# Altium project ESC.PrjPcb
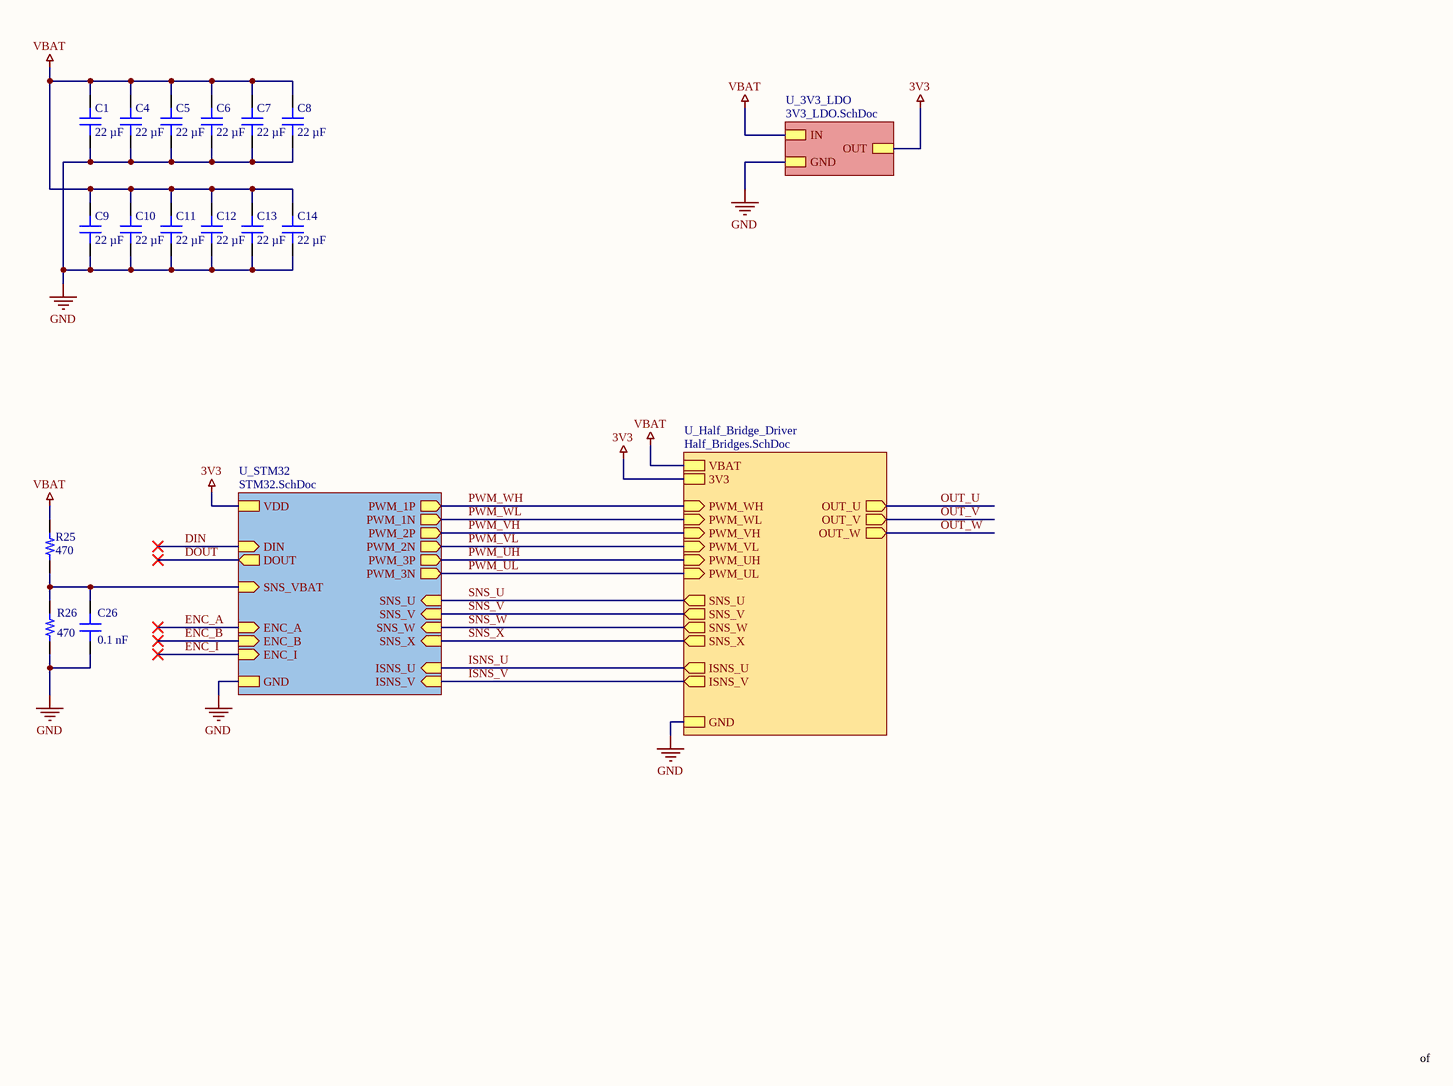
[diagram p0: Top.SchDoc]
DrawnBy: Shivam Sharma; Project: ESC; Revision: 1.0
4 sheets, 65 parts. Net scope: strictly hierarchical (ports join the sheet entries above them; power ports are local).
Board file: ESC.PcbDoc
Sheets:
  Top.SchDoc
    U_STM32 = STM32.SchDoc
    U_Half_Bridge_Driver = Half_Bridges.SchDoc
    U_3V3_LDO = 3V3_LDO.SchDoc

## Sheet Top.SchDoc
size B; SheetNumber: 1; SheetTotal: 4

### Parts
C1  22 µF  [CAP 0805_2012]
C4  22 µF  [CAP 0805_2012]
C5  22 µF  [CAP 0805_2012]
C6  22 µF  [CAP 0805_2012]
C7  22 µF  [CAP 0805_2012]
C8  22 µF  [CAP 0805_2012]
C9  22 µF  [CAP 0805_2012]
C10  22 µF  [CAP 0805_2012]
C11  22 µF  [CAP 0805_2012]
C12  22 µF  [CAP 0805_2012]
C13  22 µF  [CAP 0805_2012]
C14  22 µF  [CAP 0805_2012]
C26  0.1 nF  [CAP 0402_1005]
R25  470  [RES 0402_1005]
R26  470  [RES 0402_1005]

### Sub-sheets
U_3V3_LDO = 3V3_LDO.SchDoc: OUT, IN, GND
U_Half_Bridge_Driver = Half_Bridges.SchDoc: VBAT, GND, PWM_UH (in), PWM_UL (in), PWM_VH (in), PWM_VL (in), PWM_WH (in), PWM_WL (in), SNS_U (out), SNS_V (out), SNS_W (out), SNS_X (out), OUT_U (out), OUT_V (out), OUT_W (out), ISNS_U (out), ISNS_V (out), 3V3
U_STM32 = STM32.SchDoc: VDD, GND, PWM_2N (out), PWM_3N (out), PWM_1N (out), PWM_1P (out), PWM_2P (out), PWM_3P (out), ISNS_V (in), ISNS_U (in), SNS_X (in), SNS_W (in), SNS_V (in), SNS_U (in), ENC_A (in), ENC_B (in), ENC_I (in), DIN (in), DOUT (out), SNS_VBAT (in)

### Nets
3V3: sheet U_STM32/VDD, sheet U_Half_Bridge_Driver/3V3, sheet U_3V3_LDO/OUT
GND: C1.1 C4.1 C5.1 C6.1 C7.1 C8.1 C9.1 C10.1 C11.1 C12.1 C13.1 C14.1 C26.1 R26.1 ; sheet U_STM32/GND, sheet U_Half_Bridge_Driver/GND, sheet U_3V3_LDO/GND
VBAT: C1.2 C4.2 C5.2 C6.2 C7.2 C8.2 C9.2 C10.2 C11.2 C12.2 C13.2 C14.2 R25.2 ; sheet U_Half_Bridge_Driver/VBAT, sheet U_3V3_LDO/IN
ISNS_U: sheet U_STM32/ISNS_U, sheet U_Half_Bridge_Driver/ISNS_U
ISNS_V: sheet U_STM32/ISNS_V, sheet U_Half_Bridge_Driver/ISNS_V
PWM_UH: sheet U_STM32/PWM_3P, sheet U_Half_Bridge_Driver/PWM_UH
PWM_UL: sheet U_STM32/PWM_3N, sheet U_Half_Bridge_Driver/PWM_UL
PWM_VH: sheet U_STM32/PWM_2P, sheet U_Half_Bridge_Driver/PWM_VH
PWM_VL: sheet U_STM32/PWM_2N, sheet U_Half_Bridge_Driver/PWM_VL
PWM_WH: sheet U_STM32/PWM_1P, sheet U_Half_Bridge_Driver/PWM_WH
PWM_WL: sheet U_STM32/PWM_1N, sheet U_Half_Bridge_Driver/PWM_WL
SNS_U: sheet U_STM32/SNS_U, sheet U_Half_Bridge_Driver/SNS_U
SNS_V: sheet U_STM32/SNS_V, sheet U_Half_Bridge_Driver/SNS_V
SNS_VBAT: C26.2 R25.1 R26.2 ; sheet U_STM32/SNS_VBAT
SNS_W: sheet U_STM32/SNS_W, sheet U_Half_Bridge_Driver/SNS_W
SNS_X: sheet U_STM32/SNS_X, sheet U_Half_Bridge_Driver/SNS_X

### Notes on the sheet
- of

### Library data of the parts
C1 C4-C14 = CC0805MKX5R8BB226: CAP CER 22UF 25V X5R 0805; manufacturer: Yageo; Tolerance: ±20%; Part Number: CC0805MKX5R8BB226; Value: 22 µF; Applications: General Purpose; Capacitance: 22 µF; componentlink1description: Datasheet; componentlink1url: https://www.yageo.com/upload/media/product/productsearch/datasheet/mlcc/UPY-GPHC_X5R_4V-to-50V_25.pdf; componentlink2description: DigiKey Link; componentlink2url: https://www.digikey.com/en/products/detail/yageo/CC0805MKX5R8BB226/5195309; Device Package: 0805 (2012 Metric); lastupdated: 8/21/2022 8:03:23 PM; Lifecycle Status: Active; Minimum Order: 1; Mounting Type: Surface Mount, MLCC; Operating Temperature: -55°C ~ 85°C; Package / Case: 0805 (2012 Metric); packaging: TapeAndReel; partid: 39226; Part Status: Active; price: 0.10; series: CC; Size / Dimension: 0.079" L x 0.049" W (2.00mm x 1.25mm); Supplier 1: DigiKey; Supplier Part Number 1: 311-1903-1-ND; Temperature Coefficient: X5R; Thickness (Max): 0.057" (1.45mm); Voltage - Rated: 25V
C26 = C0402C104K4RACAUTO: CAP CER 0.1UF 16V X7R 0402; manufacturer: KEMET; Capacitance: 0.1 µF; Tolerance: ±10%; Part Number: C0402C104K4RACAUTO; Value: 0.1 nF; Applications: Automotive, Bypass, Decoupling; componentlink1description: Datasheet; componentlink1url: https://api.kemet.com/component-edge/download/specsheet/C0402C104K4RACAUTO.pdf; componentlink2description: DigiKey Link; componentlink2url: https://www.digikey.com/en/products/detail/kemet/C0402C104K4RACAUTO/3314827; Device Package: 0402 (1005 Metric); lastupdated: 8/14/2022 9:05:51 PM; Lifecycle Status: Active; Minimum Order: 1; Mounting Type: Surface Mount, MLCC; Operating Temperature: -55°C ~ 125°C; Package / Case: 0402 (1005 Metric); packaging: TapeAndReel; partid: 3024; Part Status: Active; price: 0.01; Ratings: AEC-Q200; series: SMD Auto X7R; Size / Dimension: 0.039" L x 0.020" W (1.00mm x 0.50mm); Supplier 1: DigiKey; Supplier Part Number 1: 399-6828-1-ND; Temperature Coefficient: X7R; Thickness (Max): 0.022" (0.55mm); Voltage - Rated: 16V
R25 R26 = RK73H1ETTP1432F: RES 14.3K OHM 1% 1/10W 0402; Manufacturer: KOA Speer Electronics, Inc.; Power (Watts): 0.1W, 1/10W; Resistance: 14.3 kOhms; Temperature Coefficient: ±100ppm/°C; Part Number: RK73H1ETTP1432F; Value: 470; ComponentLink1Description: Datasheet; ComponentLink1URL: http://www.koaspeer.com/catimages/Products/RK73H/RK73H.pdf; ComponentLink2Description: DigiKey Link; ComponentLink2URL: https://www.digikey.com/en/products/detail/koa-speer-electronics-inc/RK73H1ETTP1432F/9844351; Composition: Thick Film; Device Package: 0402 (1005 Metric); Features: Automotive AEC-Q200, Moisture Resistant; Height - Seated (Max): 0.016" (0.40mm); LastUpdated: 8/14/2022 9:23:49 PM; Lifecycle Status: Active; Minimum Order: 1; Number of Terminations: 2; Operating Temperature: -55°C ~ 155°C; Package / Case: 0402 (1005 Metric); Packaging: CutTape; PartId: 10193; Part Status: Active; Price: 0.01; Ratings: AEC-Q200; Series: RK73H; Size / Dimension: 0.039" L x 0.020" W (1.00mm x 0.50mm); Supplier 1: DigiKey; Supplier Part Number 1: 2019-RK73H1ETTP1432FCT-ND; Supplier Device Package: 0402; Tolerance: ±1%

## Sheet STM32.SchDoc
size A; SheetNumber: 2; SheetTotal: 4
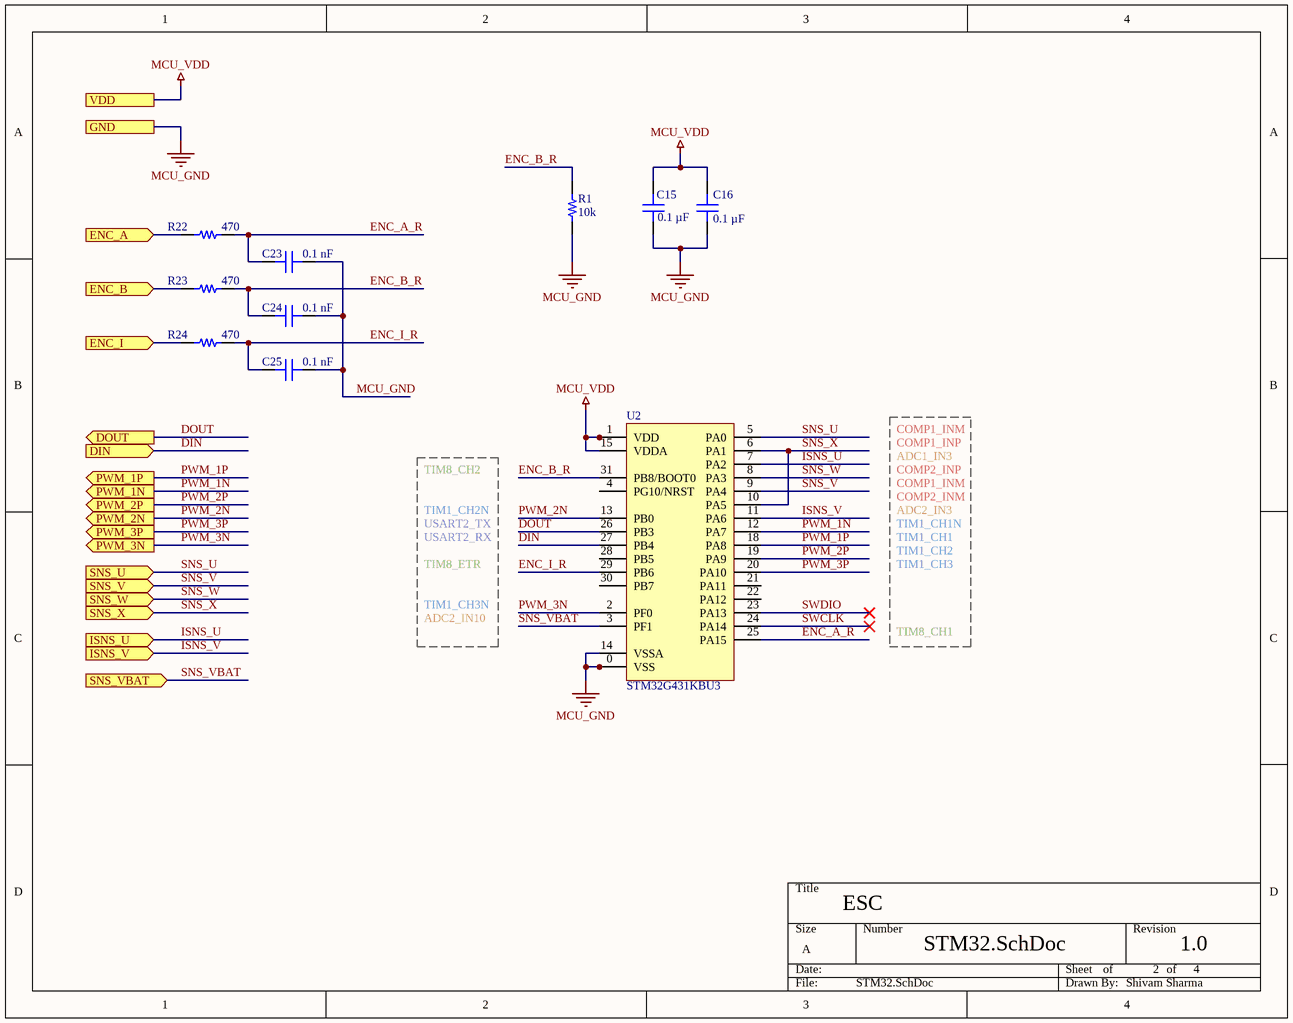
[diagram p1: STM32.SchDoc]

### Parts
C15  0.1 µF  [CAP 0402_1005]
C16  0.1 µF  [CAP 0402_1005]
C23  0.1 nF  [CAP 0402_1005]
C24  0.1 nF  [CAP 0402_1005]
C25  0.1 nF  [CAP 0402_1005]
R1  10k  [RES 0402_1005]
R22  470  [RES 0402_1005]
R23  470  [RES 0402_1005]
R24  470  [RES 0402_1005]
U2  STM32G431KBU3  [QFN50P400X400X60-32N]

### Ports
DIN (in), DOUT (out), ENC_A (in), ENC_B (in), ENC_I (in), GND, ISNS_U (in), ISNS_V (in), PWM_1N (out), PWM_1P (out), PWM_2N (out), PWM_2P (out), PWM_3N (out), PWM_3P (out), SNS_U (in), SNS_V (in), SNS_VBAT (in), SNS_W (in), SNS_X (in), VDD

### Nets
MCU_GND: C15.1 C16.1 C23.2 C24.2 C25.2 R1.1 U2.0(VSS) U2.14(VSSA) U2.16(VSS) U2.32(VSS) ; port GND  [project net GND]
MCU_VDD: C15.2 C16.2 U2.1(VDD) U2.15(VDDA) U2.17(VDD) ; port VDD  [project net 3V3]
DIN: U2.27(PB4) ; port DIN
DOUT: U2.26(PB3) ; port DOUT
ENC_A: R22.1 ; port ENC_A
ENC_A_R: C23.1 R22.2 U2.25(PA15)
ENC_B: R23.1 ; port ENC_B
ENC_B_R: C24.1 R1.2 R23.2 U2.31(PB8/BOOT0)
ENC_I: R24.1 ; port ENC_I
ENC_I_R: C25.1 R24.2 U2.29(PB6)
ISNS_U: U2.7(PA2) ; port ISNS_U
ISNS_V: U2.11(PA6) ; port ISNS_V
PWM_1N: U2.12(PA7) ; port PWM_1N  [project net PWM_WL]
PWM_1P: U2.18(PA8) ; port PWM_1P  [project net PWM_WH]
PWM_2N: U2.13(PB0) ; port PWM_2N  [project net PWM_VL]
PWM_2P: U2.19(PA9) ; port PWM_2P  [project net PWM_VH]
PWM_3N: U2.2(PF0) ; port PWM_3N  [project net PWM_UL]
PWM_3P: U2.20(PA10) ; port PWM_3P  [project net PWM_UH]
SNS_U: U2.5(PA0) ; port SNS_U
SNS_V: U2.9(PA4) ; port SNS_V
SNS_VBAT: U2.3(PF1) ; port SNS_VBAT
SNS_W: U2.8(PA3) ; port SNS_W
SNS_X: U2.6(PA1) U2.10(PA5) ; port SNS_X
SWCLK: U2.24(PA14)
SWDIO: U2.23(PA13)

Not connected (* = marked no-connect by the designer): U2 4(PG10/NRST) 21(PA11) 22(PA12) 28(PB5) 30(PB7)

### Notes on the sheet
- COMP1_INM
- TIM8_CH2
- COMP1_INP
- ADC1_IN3
- COMP2_INP
- COMP2_INM
- TIM1_CH2N
- USART2_TX
- USART2_RX
- TIM8_ETR
- ADC2_IN3
- TIM1_CH1N
- TIM1_CH1
- TIM1_CH2
- TIM1_CH3
- TIM1_CH3N
- ADC2_IN10
- TIM8_CH1
- of

### Library data of the parts
C15 C16 = C0402C104K4RACAUTO: CAP CER 0.1UF 16V X7R 0402; manufacturer: KEMET; Tolerance: ±10%; Part Number: C0402C104K4RACAUTO; Value: 0.1 µF; Applications: Automotive, Bypass, Decoupling; Capacitance: 0.1 µF; componentlink1description: Datasheet; componentlink1url: https://api.kemet.com/component-edge/download/specsheet/C0402C104K4RACAUTO.pdf; componentlink2description: DigiKey Link; componentlink2url: https://www.digikey.com/en/products/detail/kemet/C0402C104K4RACAUTO/3314827; Device Package: 0402 (1005 Metric); lastupdated: 8/14/2022 9:05:51 PM; Lifecycle Status: Active; Minimum Order: 1; Mounting Type: Surface Mount, MLCC; Operating Temperature: -55°C ~ 125°C; Package / Case: 0402 (1005 Metric); packaging: TapeAndReel; partid: 3024; Part Status: Active; price: 0.01; Ratings: AEC-Q200; series: SMD Auto X7R; Size / Dimension: 0.039" L x 0.020" W (1.00mm x 0.50mm); Supplier 1: DigiKey; Supplier Part Number 1: 399-6828-1-ND; Temperature Coefficient: X7R; Thickness (Max): 0.022" (0.55mm); Voltage - Rated: 16V
C23-C25 = C0402C104K4RACAUTO: as C26 on sheet Top; Part Number: C0402C104K4RACAUTO; Value: 0.1 nF; Applications: Automotive, Bypass, Decoupling; componentlink1description: Datasheet; componentlink1url: https://api.kemet.com/component-edge/download/specsheet/C0402C104K4RACAUTO.pdf; componentlink2description: DigiKey Link; componentlink2url: https://www.digikey.com/en/products/detail/kemet/C0402C104K4RACAUTO/3314827; Device Package: 0402 (1005 Metric); lastupdated: 8/14/2022 9:05:51 PM; Lifecycle Status: Active; Minimum Order: 1; Mounting Type: Surface Mount, MLCC; Operating Temperature: -55°C ~ 125°C; Package / Case: 0402 (1005 Metric); packaging: TapeAndReel; partid: 3024; Part Status: Active; price: 0.01; Ratings: AEC-Q200; series: SMD Auto X7R; Size / Dimension: 0.039" L x 0.020" W (1.00mm x 0.50mm); Supplier 1: DigiKey; Supplier Part Number 1: 399-6828-1-ND; Temperature Coefficient: X7R; Thickness (Max): 0.022" (0.55mm); Voltage - Rated: 16V
R1 R22-R24 = RK73H1ETTP1432F: as R25 on sheet Top; Part Number: RK73H1ETTP1432F; ComponentLink1Description: Datasheet; ComponentLink1URL: http://www.koaspeer.com/catimages/Products/RK73H/RK73H.pdf; ComponentLink2Description: DigiKey Link; ComponentLink2URL: https://www.digikey.com/en/products/detail/koa-speer-electronics-inc/RK73H1ETTP1432F/9844351; Composition: Thick Film; Device Package: 0402 (1005 Metric); Features: Automotive AEC-Q200, Moisture Resistant; Height - Seated (Max): 0.016" (0.40mm); LastUpdated: 8/14/2022 9:23:49 PM; Lifecycle Status: Active; Minimum Order: 1; Number of Terminations: 2; Operating Temperature: -55°C ~ 155°C; Package / Case: 0402 (1005 Metric); Packaging: CutTape; PartId: 10193; Part Status: Active; Price: 0.01; Ratings: AEC-Q200; Series: RK73H; Size / Dimension: 0.039" L x 0.020" W (1.00mm x 0.50mm); Supplier 1: DigiKey; Supplier Part Number 1: 2019-RK73H1ETTP1432FCT-ND; Supplier Device Package: 0402; Tolerance: ±1%
  R1: Value: 10k
  R22-R24: Value: 470
U2 = STM32G431KBU3: MCU UFQFPN-32

## Sheet Half_Bridges.SchDoc
size B; SheetNumber: 3; SheetTotal: 4
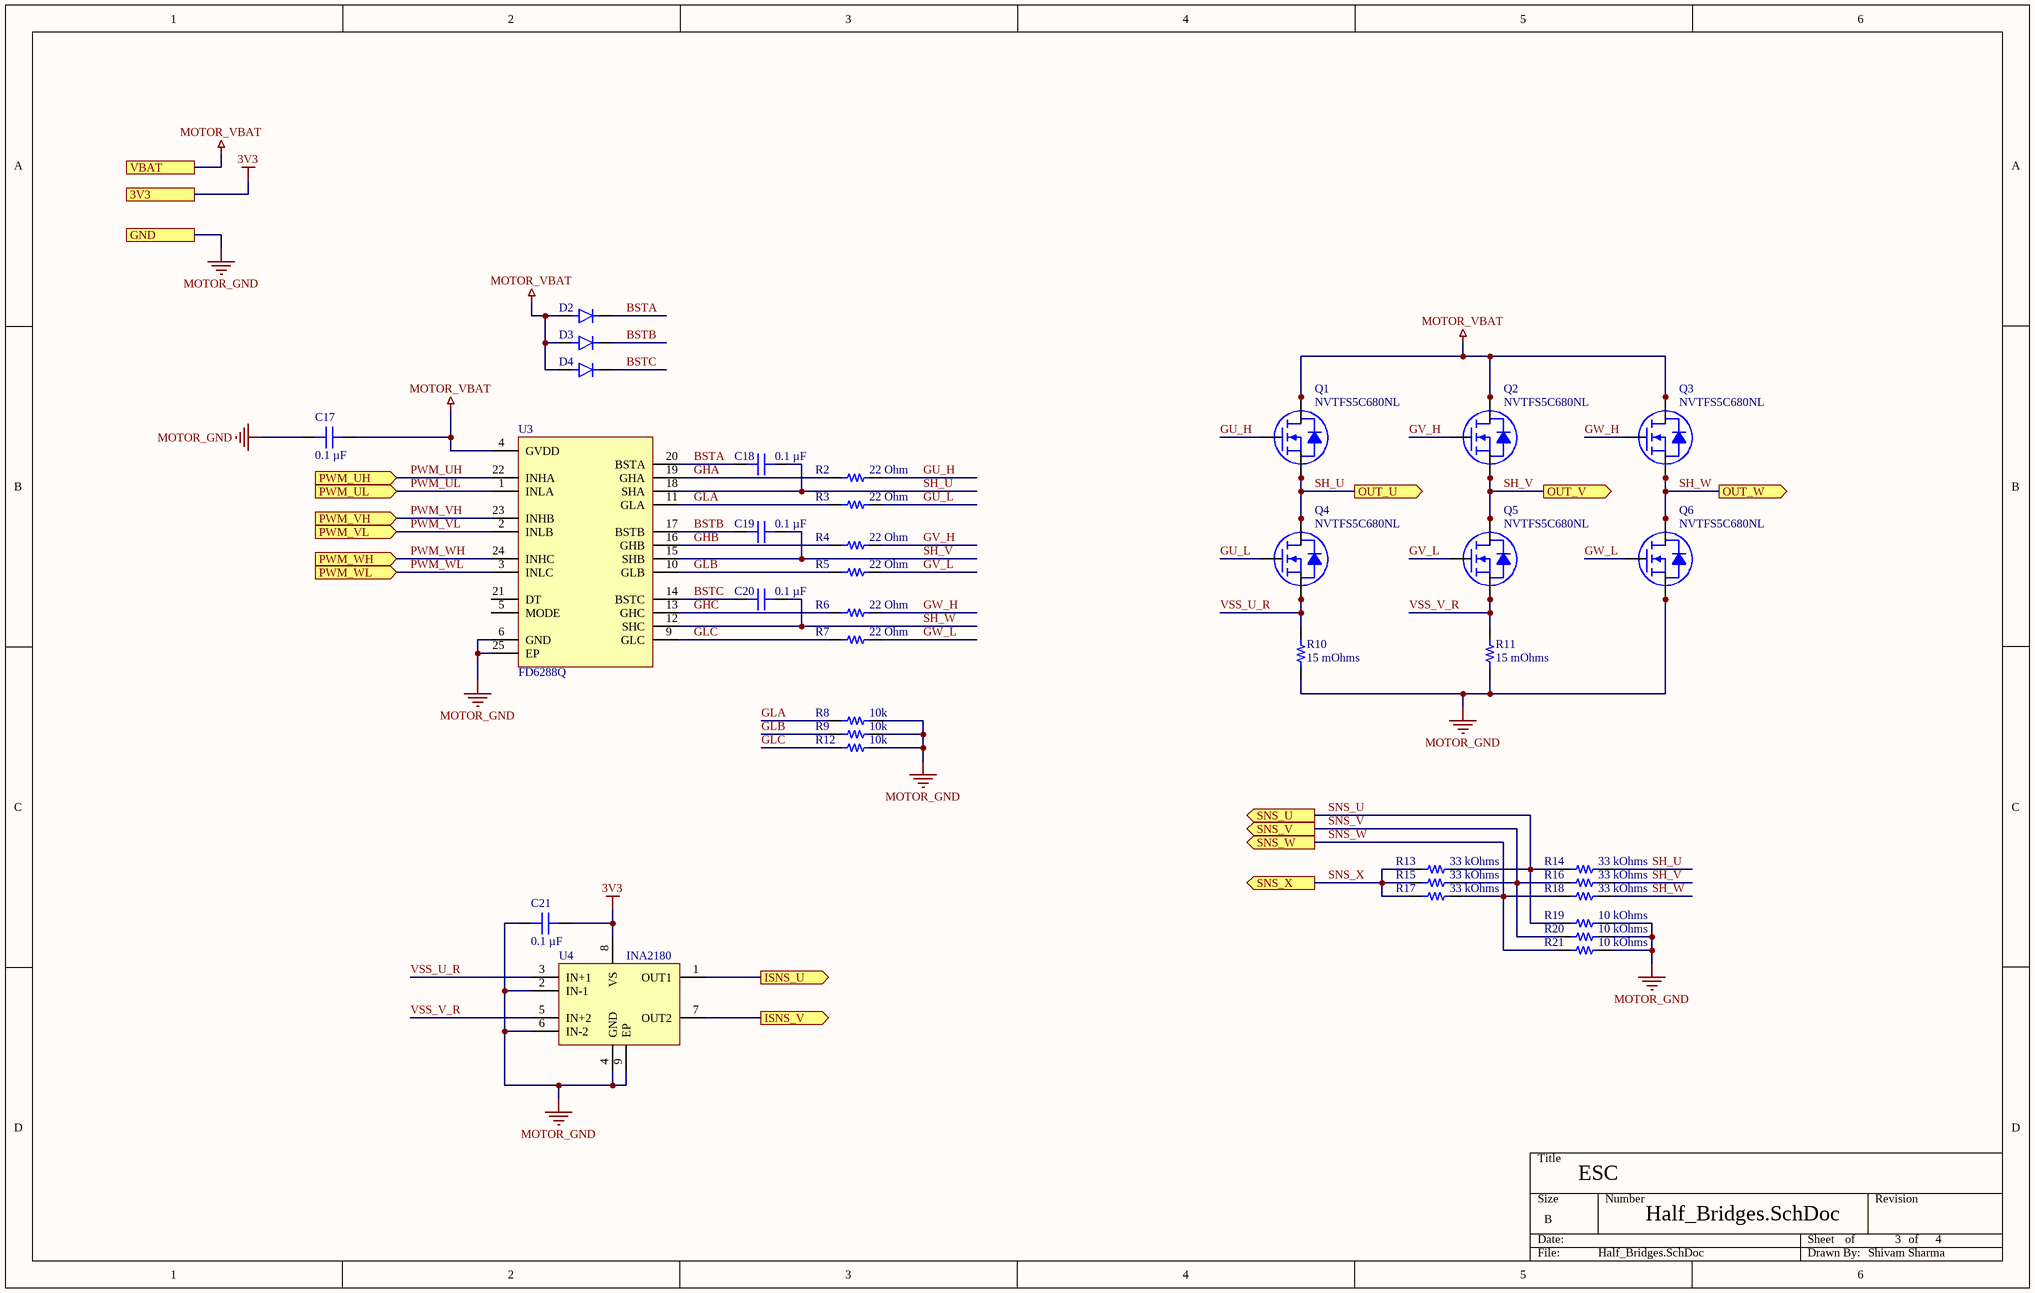
[diagram p2: Half_Bridges.SchDoc]

### Parts
C17  0.1 µF  [CAP 0402_1005]
C18  0.1 µF  [CAP 0402_1005]
C19  0.1 µF  [CAP 0402_1005]
C20  0.1 µF  [CAP 0402_1005]
C21  0.1 µF  [CAP 0402_1005]
D2  Diode  [Diode DFN1608D-2 (SOD1608)]  (value not drawn)
D3  Diode  [Diode DFN1608D-2 (SOD1608)]  (value not drawn)
D4  Diode  [Diode DFN1608D-2 (SOD1608)]  (value not drawn)
Q1  NVTFS5C680NL  [NVTFS015N04CTAG]
Q2  NVTFS5C680NL  [NVTFS015N04CTAG]
Q3  NVTFS5C680NL  [NVTFS015N04CTAG]
Q4  NVTFS5C680NL  [NVTFS015N04CTAG]
Q5  NVTFS5C680NL  [NVTFS015N04CTAG]
Q6  NVTFS5C680NL  [NVTFS015N04CTAG]
R2  22 Ohm  [RES 0402_1005]
R3  22 Ohm  [RES 0402_1005]
R4  22 Ohm  [RES 0402_1005]
R5  22 Ohm  [RES 0402_1005]
R6  22 Ohm  [RES 0402_1005]
R7  22 Ohm  [RES 0402_1005]
R8  10k  [RES 0402_1005]
R9  10k  [RES 0402_1005]
R10  15 mOhms  [RES 0805_2012]
R11  15 mOhms  [RES 0805_2012]
R12  10k  [RES 0402_1005]
R13  33 kOhms  [RES 0402_1005]
R14  33 kOhms  [RES 0402_1005]
R15  33 kOhms  [RES 0402_1005]
R16  33 kOhms  [RES 0402_1005]
R17  33 kOhms  [RES 0402_1005]
R18  33 kOhms  [RES 0402_1005]
R19  10 kOhms  [RES 0402_1005]
R20  10 kOhms  [RES 0402_1005]
R21  10 kOhms  [RES 0402_1005]
U3  FD6288Q  [QFN50P400X400X100-25N]
U4  INA2180  [WSON-8_2x2]

### Ports
3V3, GND, ISNS_U (out), ISNS_V (out), OUT_U (out), OUT_V (out), OUT_W (out), PWM_UH (in), PWM_UL (in), PWM_VH (in), PWM_VL (in), PWM_WH (in), PWM_WL (in), SNS_U (out), SNS_V (out), SNS_W (out), SNS_X (out), VBAT

### Nets
3V3: C21.1 U4.8(VS) ; port 3V3
MOTOR_GND: C17.1 C21.2 Q6.1(S) Q6.2(S) Q6.3(S) R8.2 R9.2 R10.1 R11.1 R12.2 R19.1 R20.1 R21.1 U3.6(GND) U3.25(EP) U4.2(IN-1) U4.4(GND) U4.6(IN-2) U4.9(EP) ; port GND  [project net GND]
MOTOR_VBAT: C17.2 D2.2(BLUE(C)) D3.2(BLUE(C)) D4.2(BLUE(C)) Q1.5(D) Q1.6(D) Q1.7(D) Q1.8(D) Q2.5(D) Q2.6(D) Q2.7(D) Q2.8(D) Q3.5(D) Q3.6(D) Q3.7(D) Q3.8(D) U3.4(GVDD) ; port VBAT  [project net VBAT]
BSTA: C18.1 D2.1(A) U3.20(BSTA)
BSTB: C19.1 D3.1(A) U3.17(BSTB)
BSTC: C20.1 D4.1(A) U3.14(BSTC)
GHA: R2.1 U3.19(GHA)
GHB: R4.1 U3.16(GHB)
GHC: R6.1 U3.13(GHC)
GLA: R3.1 R8.1 U3.11(GLA)
GLB: R5.1 R9.1 U3.10(GLB)
GLC: R7.1 R12.1 U3.9(GLC)
GU_H: Q1.4(G) R2.2
GU_L: Q4.4(G) R3.2
GV_H: Q2.4(G) R4.2
GV_L: Q5.4(G) R5.2
GW_H: Q3.4(G) R6.2
GW_L: Q6.4(G) R7.2
ISNS_U: U4.1(OUT1) ; port ISNS_U
ISNS_V: U4.7(OUT2) ; port ISNS_V
PWM_UH: U3.22(INHA) ; port PWM_UH
PWM_UL: U3.1(INLA) ; port PWM_UL
PWM_VH: U3.23(INHB) ; port PWM_VH
PWM_VL: U3.2(INLB) ; port PWM_VL
PWM_WH: U3.24(INHC) ; port PWM_WH
PWM_WL: U3.3(INLC) ; port PWM_WL
SH_U: C18.2 Q1.1(S) Q1.2(S) Q1.3(S) Q4.5(D) Q4.6(D) Q4.7(D) Q4.8(D) R14.2 U3.18(SHA) ; port OUT_U  [project net OUT_U]
SH_V: C19.2 Q2.1(S) Q2.2(S) Q2.3(S) Q5.5(D) Q5.6(D) Q5.7(D) Q5.8(D) R16.2 U3.15(SHB) ; port OUT_V  [project net OUT_V]
SH_W: C20.2 Q3.1(S) Q3.2(S) Q3.3(S) Q6.5(D) Q6.6(D) Q6.7(D) Q6.8(D) R18.2 U3.12(SHC) ; port OUT_W  [project net OUT_W]
SNS_U: R13.2 R14.1 R19.2 ; port SNS_U
SNS_V: R15.2 R16.1 R20.2 ; port SNS_V
SNS_W: R17.2 R18.1 R21.2 ; port SNS_W
SNS_X: R13.1 R15.1 R17.1 ; port SNS_X
VSS_U_R: Q4.1(S) Q4.2(S) Q4.3(S) R10.2 U4.3(IN+1)
VSS_V_R: Q5.1(S) Q5.2(S) Q5.3(S) R11.2 U4.5(IN+2)

Not connected (* = marked no-connect by the designer): U3 5(MODE) 21(DT)

### Notes on the sheet
- of

### Library data of the parts
C17-C21 = C0402C104K4RACAUTO: as C15 on sheet STM32; Part Number: C0402C104K4RACAUTO; Value: 0.1 µF; Applications: Automotive, Bypass, Decoupling; Capacitance: 0.1 µF; componentlink1description: Datasheet; componentlink1url: https://api.kemet.com/component-edge/download/specsheet/C0402C104K4RACAUTO.pdf; componentlink2description: DigiKey Link; componentlink2url: https://www.digikey.com/en/products/detail/kemet/C0402C104K4RACAUTO/3314827; Device Package: 0402 (1005 Metric); lastupdated: 8/14/2022 9:05:51 PM; Lifecycle Status: Active; Minimum Order: 1; Mounting Type: Surface Mount, MLCC; Operating Temperature: -55°C ~ 125°C; Package / Case: 0402 (1005 Metric); packaging: TapeAndReel; partid: 3024; Part Status: Active; price: 0.01; Ratings: AEC-Q200; series: SMD Auto X7R; Size / Dimension: 0.039" L x 0.020" W (1.00mm x 0.50mm); Supplier 1: DigiKey; Supplier Part Number 1: 399-6828-1-ND; Temperature Coefficient: X7R; Thickness (Max): 0.022" (0.55mm); Voltage - Rated: 16V
D2-D4 = Diode: DFN1608D-2 (SOD1608); Manufacturer: Cree; ComponentLink2Description: Datasheet; Temperature: -40°C to +100°C; Package: LED_3MM2X2MM8; Supplier 2: Mouser; Price: 0.203999996142; Supplier 1: Digi-Key; ComponentLink1URL: https://upverter.com/upn/revision/9d0b31f7b1982705/; Supplier Part Number 2: 941-CLV1LFKBC7673673; Supplier Part Number 1: CLV1L-FKB-CHMMQEHBB7673673-ND; ComponentLink1Description: Upverter; ComponentLink2URL: http://www.cree.com/~/media/Files/Cree/LED-Components-and-Modules/HB/Data-Sheets/CLV1L-FKB-1238.pdf; RoHS: TRUE; Mouser Part Number: 941-CLV1LFKBC7673673; Temperature Range High: +100°C; Digikey Description: DIODE LED RGB DIFFUSED 4LCC SMD; Digikey Part Number: CLV1L-FKB-CHMMQEHBB7673673-ND; Lead Free: yes; Temperature Range Low: -40°C
Q1-Q6 = NVTFS5C680NL: N-FET
R2-R9 R12-R21 = RK73H1ETTP1432F: as R25 on sheet Top; Part Number: RK73H1ETTP1432F; ComponentLink1Description: Datasheet; ComponentLink1URL: http://www.koaspeer.com/catimages/Products/RK73H/RK73H.pdf; ComponentLink2Description: DigiKey Link; ComponentLink2URL: https://www.digikey.com/en/products/detail/koa-speer-electronics-inc/RK73H1ETTP1432F/9844351; Composition: Thick Film; Device Package: 0402 (1005 Metric); Features: Automotive AEC-Q200, Moisture Resistant; Height - Seated (Max): 0.016" (0.40mm); LastUpdated: 8/14/2022 9:23:49 PM; Lifecycle Status: Active; Minimum Order: 1; Number of Terminations: 2; Operating Temperature: -55°C ~ 155°C; Package / Case: 0402 (1005 Metric); Packaging: CutTape; PartId: 10193; Part Status: Active; Price: 0.01; Ratings: AEC-Q200; Series: RK73H; Size / Dimension: 0.039" L x 0.020" W (1.00mm x 0.50mm); Supplier 1: DigiKey; Supplier Part Number 1: 2019-RK73H1ETTP1432FCT-ND; Supplier Device Package: 0402; Tolerance: ±1%
  R2-R7: Value: 22 Ohm
  R8 R9 R12: Value: 10k
  R13-R18: Value: 33 kOhms
  R19-R21: Value: 10 kOhms
R10 R11 = PCAN0805E2002BST5: RES SMD 20K OHM 0.1% 1W 0805; Manufacturer: Vishay Thin Film; Resistance: 20 kOhms; Temperature Coefficient: ±25ppm/°C; Part Number: PCAN0805E2002BST5; Value: 15 mOhms; ComponentLink1Description: Datasheet; ComponentLink1URL: http://www.vishay.com/docs/60125/pcan.pdf; ComponentLink2Description: DigiKey Link; ComponentLink2URL: http://digikey.com/product-detail/en/vishay-thin-film/PCAN0805E2002BST5/764-1242-1-ND/6003316; Composition: Thin Film; Device Package: 0805 (2012 Metric); Features: Flame Proof, Moisture Resistant, Safety; Height - Seated (Max): 0.018" (0.46mm); LastUpdated: 8/26/2022 12:02:22 PM; Lifecycle Status: Active; Minimum Order: 1; Number of Terminations: 2; Operating Temperature: -55°C ~ 155°C; Package / Case: 0805 (2012 Metric); Packaging: TapeAndReel; PartId: 32096; Part Status: Active; Power (Watts): 1W; Price: 0.59; Series: PCAN; Size / Dimension: 0.080" L x 0.050" W (2.03mm x 1.27mm); Supplier 1: DigiKey; Supplier Part Number 1: 764-1242-1-ND; Supplier Device Package: 0805; Tolerance: ±0.1%
U3 = FD6288Q: 3 Phase Gate Driver 1.5-2.2A; MF: Texas Instruments; MP: UCC27282DRCR; Texas_Instruments-Purchase-URL: https://snapeda.com/shop?store=Texas+Instruments&id=3625400; Price: None; Availability: Warning; Package: VSON-10 Texas Instruments; SnapEDA_Link: https://www.snapeda.com/parts/UCC27282DRCR/Texas%20Instruments/view-part/3625400/?ref=snap; DigiKey-Purchase-URL: https://snapeda.com/shop?store=DigiKey&id=3625400; Value: *
U4 = INA2180: Current sense amplifier 4 channel

## Sheet 3V3_LDO.SchDoc
size A; SheetNumber: 4; SheetTotal: 4
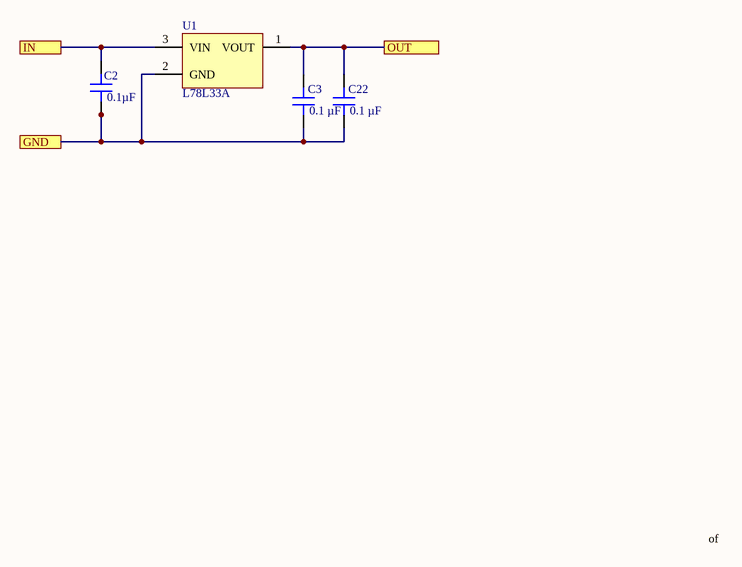
[diagram p3: 3V3_LDO.SchDoc]

### Parts
C2  0.1µF  [CAP 0603_1608]
C3  0.1 µF  [CAP 0402_1005]
C22  0.1 µF  [CAP 0402_1005]
U1  L78L33A  [SOT-89-3]

### Ports
GND, IN, OUT

### Nets
3V3: C3.2 C22.2 U1.1(VOUT) ; port OUT
GND: C2.2 C3.1 C22.1 U1.2(GND) ; port GND
VBAT: C2.1 U1.3(VIN) ; port IN

### Notes on the sheet
- of

### Library data of the parts
C2 = GCG188R92A104KA03D: CAP CER 0.1UF 100V 0603 EPOXY; Manufacturer: Murata Electronics; Temperature Coefficient: X8R; Tolerance: ±10%; Part Number: GCG188R92A104KA03D; Value: 0.1µF; Applications: Automotive; Capacitance: 0.1µF; ComponentLink1Description: Datasheet; ComponentLink1URL: https://search.murata.co.jp/Ceramy/image/img/A01X/G101/ENG/GCG188R92A104KA03-01.pdf; ComponentLink2Description: DigiKey Link; ComponentLink2URL: http://digikey.com/product-detail/en/murata-electronics/GCG188R92A104KA03D/490-18197-1-ND/9867926; Device Package: 0603 (1608 Metric); Features: Epoxy Mountable; LastUpdated: 21-Jan-20 12:01:59 AM; Lifecycle Status: Active; Minimum Order: 1; Mounting Type: Surface Mount, MLCC, Epoxy; Operating Temperature: -55°C ~ 150°C; Package / Case: 0603 (1608 Metric); Packaging: TapeAndReel; PartId: 9025; Part Status: Active; Price: 0.07; Ratings: AEC-Q200; Series: GCG; Size / Dimension: 0.063" L x 0.031" W (1.60mm x 0.80mm); Supplier 1: DigiKey; Supplier Part Number 1: 490-18197-1-ND; Thickness (Max): 0.035" (0.90mm); Voltage - Rated: 100V
C3 C22 = C0402C104K4RACAUTO: as C15 on sheet STM32; Part Number: C0402C104K4RACAUTO; Value: 0.1 µF; Applications: Automotive, Bypass, Decoupling; Capacitance: 0.1 µF; componentlink1description: Datasheet; componentlink1url: https://api.kemet.com/component-edge/download/specsheet/C0402C104K4RACAUTO.pdf; componentlink2description: DigiKey Link; componentlink2url: https://www.digikey.com/en/products/detail/kemet/C0402C104K4RACAUTO/3314827; Device Package: 0402 (1005 Metric); lastupdated: 8/14/2022 9:05:51 PM; Lifecycle Status: Active; Minimum Order: 1; Mounting Type: Surface Mount, MLCC; Operating Temperature: -55°C ~ 125°C; Package / Case: 0402 (1005 Metric); packaging: TapeAndReel; partid: 3024; Part Status: Active; price: 0.01; Ratings: AEC-Q200; series: SMD Auto X7R; Size / Dimension: 0.039" L x 0.020" W (1.00mm x 0.50mm); Supplier 1: DigiKey; Supplier Part Number 1: 399-6828-1-ND; Temperature Coefficient: X7R; Thickness (Max): 0.022" (0.55mm); Voltage - Rated: 16V
U1 = L78L33A: 3.3V LDO

## Nets that join several sheets
3V3: STM32 (5 pins), Half_Bridges (C21.1 U4.8), 3V3_LDO (C3.2 C22.2 U1.1)
GND: Top (14 pins), STM32 (10 pins), Half_Bridges (19 pins), 3V3_LDO (C2.2 C3.1 C22.1 U1.2)
VBAT: Top (13 pins), Half_Bridges (17 pins), 3V3_LDO (C2.1 U1.3)
ISNS_U: STM32 (U2.7), Half_Bridges (U4.1)
ISNS_V: STM32 (U2.11), Half_Bridges (U4.7)
PWM_UH: STM32 (U2.20), Half_Bridges (U3.22)
PWM_UL: STM32 (U2.2), Half_Bridges (U3.1)
PWM_VH: STM32 (U2.19), Half_Bridges (U3.23)
PWM_VL: STM32 (U2.13), Half_Bridges (U3.2)
PWM_WH: STM32 (U2.18), Half_Bridges (U3.24)
PWM_WL: STM32 (U2.12), Half_Bridges (U3.3)
SNS_U: STM32 (U2.5), Half_Bridges (R13.2 R14.1 R19.2)
SNS_V: STM32 (U2.9), Half_Bridges (R15.2 R16.1 R20.2)
SNS_VBAT: Top (C26.2 R25.1 R26.2), STM32 (U2.3)
SNS_W: STM32 (U2.8), Half_Bridges (R17.2 R18.1 R21.2)
SNS_X: STM32 (U2.6 U2.10), Half_Bridges (R13.1 R15.1 R17.1)

## Assembly variants
Main: all parts fitted